# Altium schematic sheet bala.SchDoc
size A4
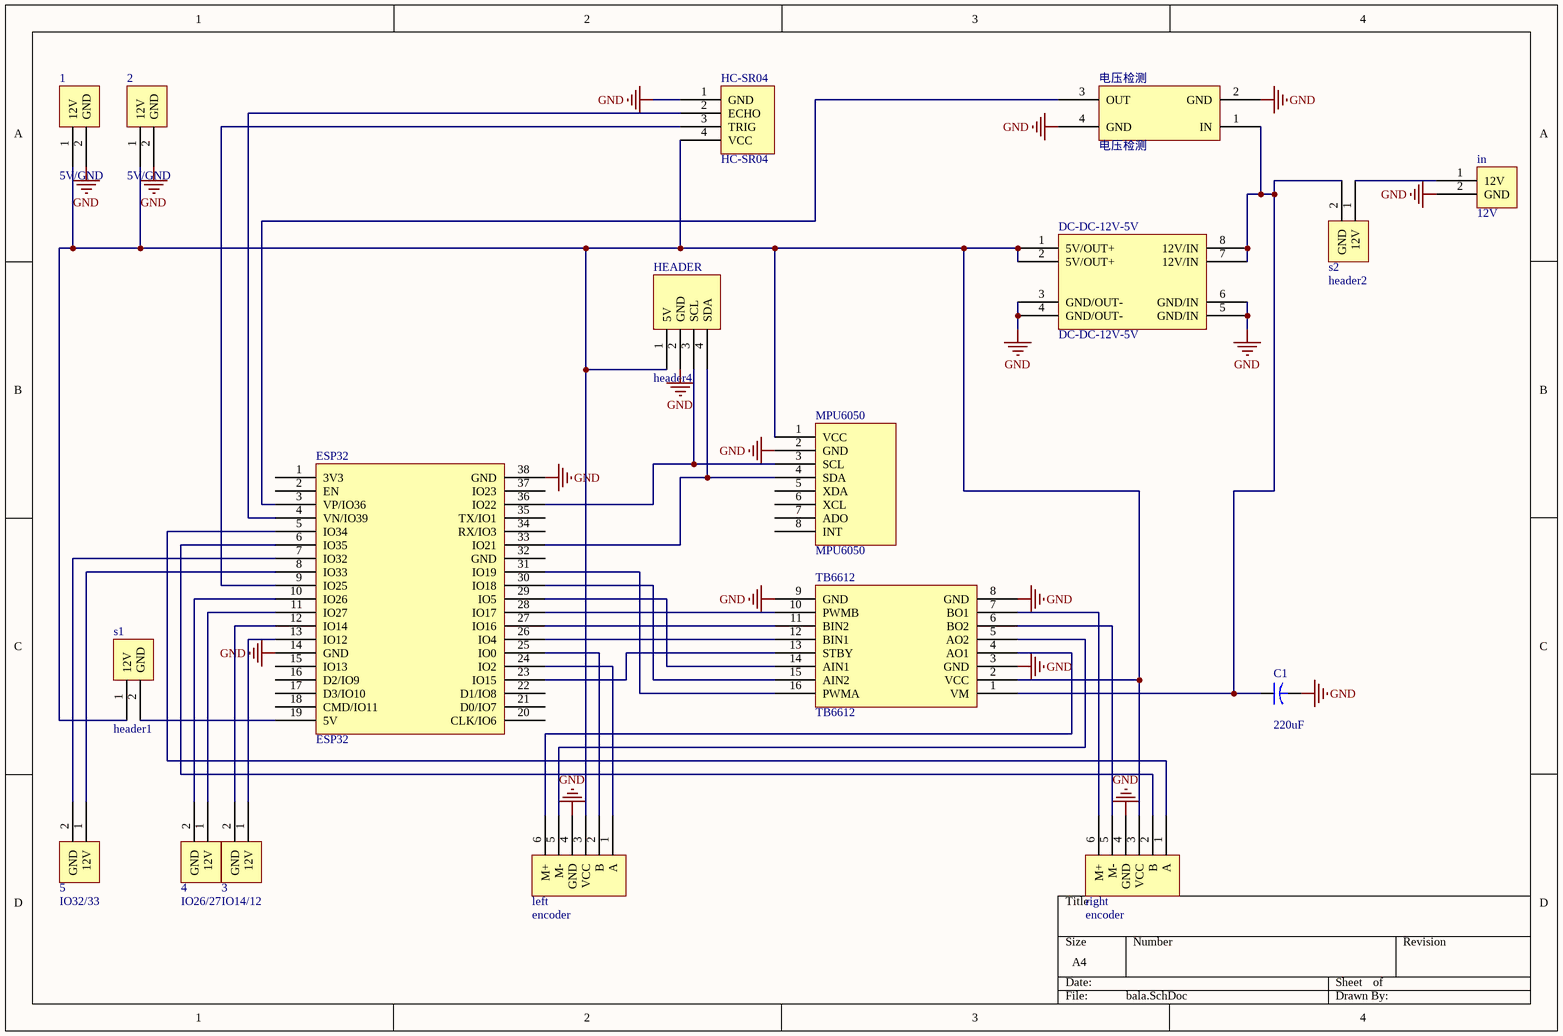
[diagram p0: bala.SchDoc]

## Parts
1  5V/GND  [PCBComponent_1]
2  5V/GND  [PCBComponent_1]
3  IO14/12  [PCBComponent_1]
4  IO26/27  [PCBComponent_1]
5  IO32/33  [PCBComponent_1]
C1  value 220uF  [CAPR5-4X5]
DC-DC-12V-5V  DC-DC-12V-5V  [PCBComponent_1]
ESP32  ESP32  [MPU6050]
HC-SR04  HC-SR04  [PCBComponent_1]
HEADER  header4  [PCBComponent_1]
in  12V  [PCBComponent_1]
left  encoder  [PCBComponent_1]
MPU6050  MPU6050  [PCBComponent_1]
right  encoder  [PCBComponent_1]
s1  header1  [PCBComponent_1]
s2  header2  [PCBComponent_1]
TB6612  TB6612  [PCBComponent_1]
电压检测  电压检测  [PCBComponent_1]

## Nets
GND: 1.2(GND) 2.2(GND) C1.2 DC-DC-12V-5V.3(GND/OUT-) DC-DC-12V-5V.4(GND/OUT-) DC-DC-12V-5V.5(GND/IN) DC-DC-12V-5V.6(GND/IN) ESP32.14(GND) ESP32.38(GND) HC-SR04.1(GND) HEADER.2(GND) in.2(GND) left.4(GND) MPU6050.2(GND) right.4(GND) TB6612.3(GND) TB6612.8(GND) TB6612.9(GND) 电压检测.2(GND) 电压检测.4(GND)
Net1_1: 1.1(12V) 2.1(12V) DC-DC-12V-5V.1(5V/OUT+) DC-DC-12V-5V.2(5V/OUT+) HC-SR04.4(VCC) HEADER.1(5V) left.3(VCC) MPU6050.1(VCC) right.3(VCC) s1.1(12V) TB6612.2(VCC)
Net3_1: 3.1(12V) ESP32.13(IO12)
Net3_2: 3.2(GND) ESP32.12(IO14)
Net4_1: 4.1(12V) ESP32.11(IO27)
Net4_2: 4.2(GND) ESP32.10(IO26)
Net5_1: 5.1(12V) ESP32.8(IO33)
Net5_2: 5.2(GND) ESP32.7(IO32)
NetC1_1: C1.1 DC-DC-12V-5V.7(12V/IN) DC-DC-12V-5V.8(12V/IN) s2.2(GND) TB6612.1(VM) 电压检测.1(IN)
NetESP32_3: ESP32.3(VP/IO36) 电压检测.3(OUT)
NetESP32_4: ESP32.4(VN/IO39) HC-SR04.2(ECHO)
NetESP32_5: ESP32.5(IO34) right.1(A)
NetESP32_6: ESP32.6(IO35) right.2(B)
NetESP32_9: ESP32.9(IO25) HC-SR04.3(TRIG)
NetESP32_19: ESP32.19(5V) s1.2(GND)
NetESP32_23: ESP32.23(IO15) TB6612.13(STBY)
NetESP32_24: ESP32.24(IO2) left.1(A)
NetESP32_25: ESP32.25(IO0) left.2(B)
NetESP32_26: ESP32.26(IO4) TB6612.12(BIN1)
NetESP32_27: ESP32.27(IO16) TB6612.11(BIN2)
NetESP32_28: ESP32.28(IO17) TB6612.10(PWMB)
NetESP32_29: ESP32.29(IO5) TB6612.14(AIN1)
NetESP32_30: ESP32.30(IO18) TB6612.15(AIN2)
NetESP32_31: ESP32.31(IO19) TB6612.16(PWMA)
NetESP32_33: ESP32.33(IO21) HEADER.4(SDA) MPU6050.4(SDA)
NetESP32_36: ESP32.36(IO22) HEADER.3(SCL) MPU6050.3(SCL)
Netin_1: in.1(12V) s2.1(12V)
Netleft_5: left.5(M-) TB6612.5(AO2)
Netleft_6: left.6(M+) TB6612.4(AO1)
Netright_5: right.5(M-) TB6612.6(BO2)
Netright_6: right.6(M+) TB6612.7(BO1)

Not connected (* = marked no-connect by the designer): ESP32 1(3V3) 2(EN) 15(IO13) 16(D2/IO9) 17(D3/IO10) 18(CMD/IO11) 20(CLK/IO6) 21(D0/IO7) 22(D1/IO8) 32(GND) 34(RX/IO3) 35(TX/IO1) 37(IO23); MPU6050 5(XDA) 6(XCL) 7(ADO) 8(INT)

## Library data of the parts
1-5 DC-DC-12V-5V ESP32 HC-SR04 HEADER in left MPU6050 right s1 s2 TB6612 电压检测 = Component_1
C1 = Cap2: Capacitor; Published: 23-Sep-2002; PackageReference: CAPR5-4X5; Publisher: Altium Limited; PackageDescription: Capacitor; 2 Leads